# Altium schematic sheet motor_driver.SchDoc
size A4; SheetNumber: 1; SheetTotal: 1
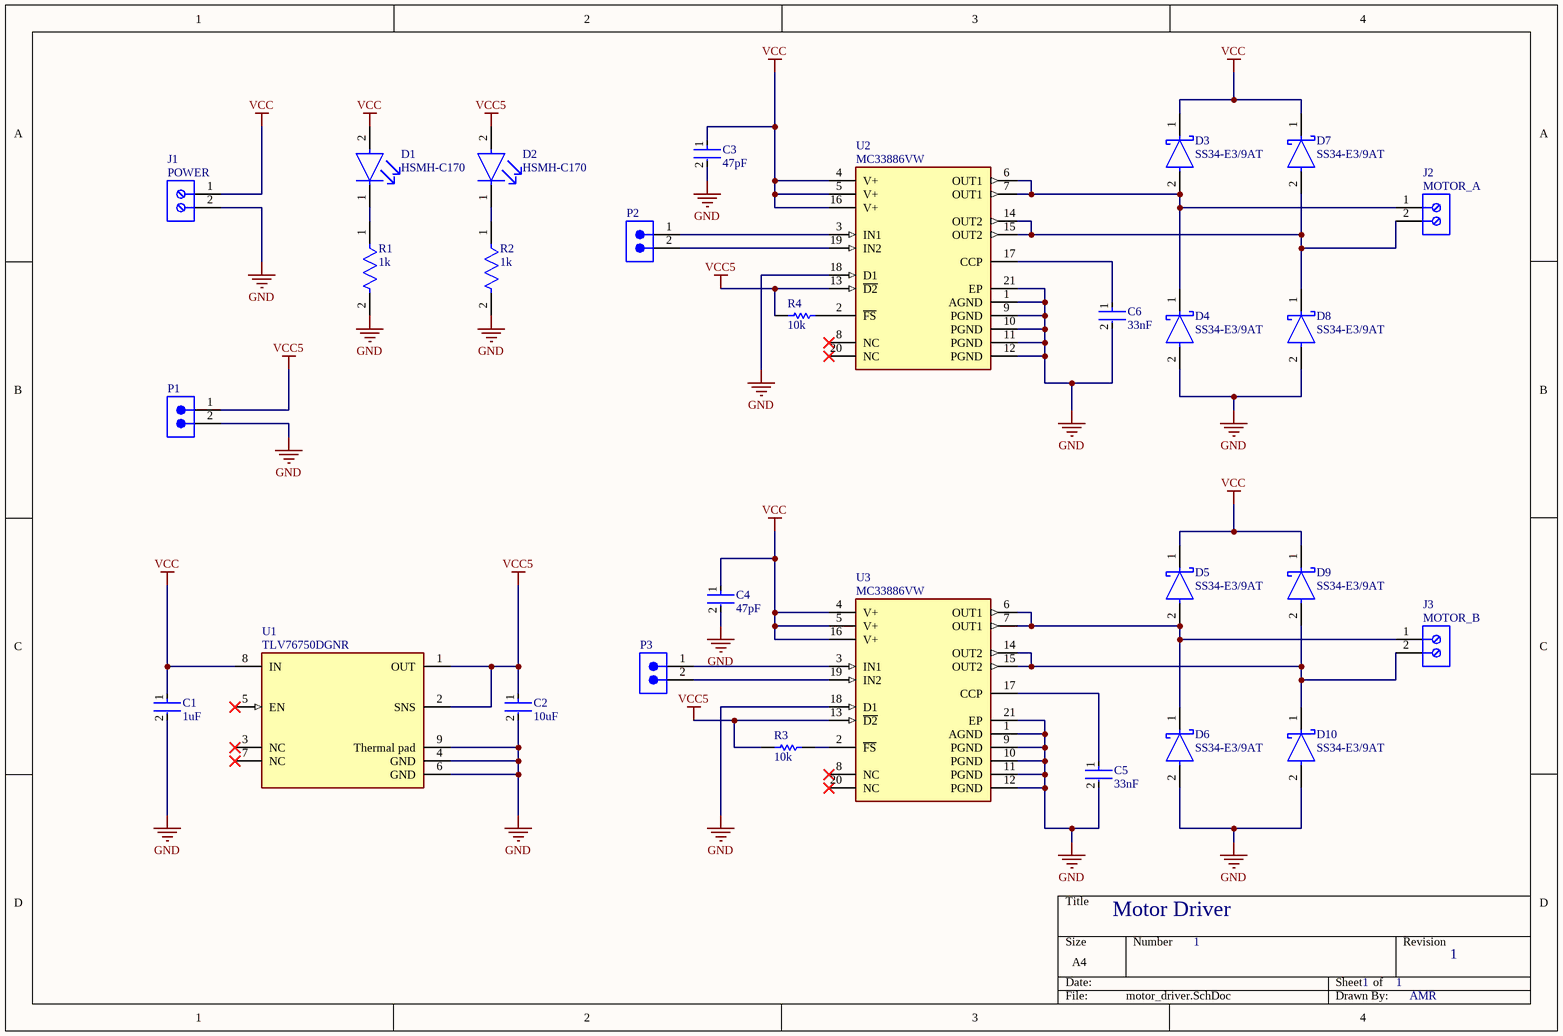
[diagram p0: motor_driver.SchDoc]

## Parts
C1  1uF  [FP-CC0603-DA-IPC_A]
C2  10uF  [FP-GRM188-0_1-e0_2_0_55-IPC_A]
C3  47pF  [FP-C0805C-DN-IPC_A]
C4  47pF  [FP-C0805C-DN-IPC_A]
C5  33nF  [FP-CC0805-0_85-MFG]
C6  33nF  [FP-CC0805-0_85-MFG]
D1  HSMH-C170  [FP-HSMS-C170-MFG]
D2  HSMH-C170  [FP-HSMS-C170-MFG]
D3  SS34-E3/9AT  [FP-SMC-MFG]
D4  SS34-E3/9AT  [FP-SMC-MFG]
D5  SS34-E3/9AT  [FP-SMC-MFG]
D6  SS34-E3/9AT  [FP-SMC-MFG]
D7  SS34-E3/9AT  [FP-SMC-MFG]
D8  SS34-E3/9AT  [FP-SMC-MFG]
D9  SS34-E3/9AT  [FP-SMC-MFG]
D10  SS34-E3/9AT  [FP-SMC-MFG]
J1  POWER  [691103110002]
J2  MOTOR_A  [691103110002]
J3  MOTOR_B  [691103110002]
P1  61300211121  [61300211121]  (value not drawn)
P2  61300211121  [61300211121]  (value not drawn)
P3  61300211121  [61300211121]  (value not drawn)
R1  1k  [FP-RC0603-0_55-IPC_B]
R2  1k  [FP-RC0603-0_55-IPC_B]
R3  10k  [RESC1609X50X30ML8T20]
R4  10k  [RESC1609X50X30ML8T20]
U1  TLV76750DGNR  [FP-DGN0008G-IPC_A]
U2  MC33886VW  [FP-SOT397-2-IPC_A]
U3  MC33886VW  [FP-SOT397-2-IPC_A]

## Nets
GND: C1.2 C2.2 C3.2 C4.2 C5.2 C6.2 D4.2(A) D6.2(A) D8.2(A) D10.2(A) J1.2 P1.2 R1.2 R2.2 U1.4(GND) U1.6(GND) U1.9(Thermal_pad) U2.1(AGND) U2.9(PGND) U2.10(PGND) U2.11(PGND) U2.12(PGND) U2.18(D1) U2.21(EP) U3.1(AGND) U3.9(PGND) U3.10(PGND) U3.11(PGND) U3.12(PGND) U3.18(D1) U3.21(EP)
VCC: C1.1 C3.1 C4.1 D1.2(A) D3.1(C) D5.1(C) D7.1(C) D9.1(C) J1.1 U1.8(IN) U2.4(V+) U2.5(V+) U2.16(V+) U3.4(V+) U3.5(V+) U3.16(V+)
VCC5: C2.1 D2.2(A) P1.1 R3.1 R4.1 U1.1(OUT) U1.2(SNS) U2.13(~{D2}) U3.13(~{D2})
NetC5_1: C5.1 U3.17(CCP)
NetC6_1: C6.1 U2.17(CCP)
NetD1_1: D1.1(C) R1.1
NetD2_1: D2.1(C) R2.1
NetD3_2: D3.2(A) D4.1(C) J2.1 U2.6(OUT1) U2.7(OUT1)
NetD5_2: D5.2(A) D6.1(C) J3.1 U3.6(OUT1) U3.7(OUT1)
NetD7_2: D7.2(A) D8.1(C) J2.2 U2.14(OUT2) U2.15(OUT2)
NetD9_2: D9.2(A) D10.1(C) J3.2 U3.14(OUT2) U3.15(OUT2)
NetP2_1: P2.1 U2.3(IN1)
NetP2_2: P2.2 U2.19(IN2)
NetP3_1: P3.1 U3.3(IN1)
NetP3_2: P3.2 U3.19(IN2)
NetR3_2: R3.2 U3.2(~{FS})
NetR4_2: R4.2 U2.2(~{FS})

Not connected (* = marked no-connect by the designer): U1 3(NC)* 5(EN)* 7(NC)*; U2 8(NC)* 20(NC)*; U3 8(NC)* 20(NC)*

## Notes on the sheet
- Motor Driver
- 1
- AMR

## Library data of the parts
C1 = CMP-2000-05002-2: CAP CER 0.1UF 16V X7R 0603; Manufacturer Part Number: CC0603KRX7R7BB104; Manufacturer: YAGEO; Tolerance: 0.1; Value: 100 nF; Temperature Coefficient: 15%; Material: Ceramic; Voltage Rating: 16 V; Package: CC0603-DA; ComponentLink2Description: Datasheet; Octopart: https://octopart.com/cc0603krx7r7bb104-yageo-192941; Temperature Range High: +125°C; Digikey Description: CAP CER 0.1UF 16V X7R 0603; Voltage: 16 V; Device Class L2: Capacitors; Height: 0.9mm; Temperature: -55°C to +125°C; Device Class L1: Passive Components; Device Class L3: Ceramic Capacitors; ComponentLink2URL: http://www.yageo.com/documents/recent/UPY-GPHC_X7R_6.3V-to-50V_18.pdf; Footprint Url: http://www.yageo.com/exep/pages/download/literatures/UPY-C_GEN_24.pdf; RoHS: TRUE; Temperature Range Low: -55°C; Temperature Characteristic: X7R; Lead Free: Yes; Capacitance: 100 nF; Category: Cap; Mouser Description: Multilayer Ceramic Capacitor, CC Series, 0.1 - F, - 10%, X7R, 16 V, 0603 [1608 Metric]; Automotive: No
C2 = CMP-2006-02792-2: Chip Multilayer Ceramic Capacitors for General Purpose, 0603, 10uF, X5R, 15%, 20%, 6.3V; Packaging: Tape and Reel; Voltage Rating (DC): 6.3V; Width: 0.031inch; Termination: SMD/SMT; Dielectric: X5R; Package Quantity: 4000; Voltage Rating: 6.3V; Capacitance: 10uF; Case/Package: 0603; Min Operating Temperature: -55°C; Voltage: 6.3V; Length: 1.6mm; Thickness: 0.035inch; Lead Free: Lead Free; Depth: 0.8mm; Case Code (Imperial): 0603; Max Operating Temperature: 85°C; Material: Ceramic; Height: 0.8mm; Tolerance: 20%; Mount: Surface Mount; REACH SVHC: No SVHC; Radiation Hardening: No; Case Code (Metric): 1608
C3 C4 = CMP-1036-01631-3: CAP CER 47PF 100V 5% NP0 0805; Manufacturer: KEMET; Manufacturer Part Number: C0805C470J1GACTU; Temperature Characteristic: C0G; Material: Ceramic; Temperature Coefficient: 30ppm/°C; Tolerance: 0.05; Value: 47 pF; Device Class L3: Ceramic Capacitors; Package: C0805C-DN; Category: Cap; ComponentLink2URL: https://content.kemet.com/datasheets/KEM_C1003_C0G_SMD.pdf; Ipc Land Pattern Name: CAPC200125X78; Temperature Range Low: -55°C; Temperature: -55°C to +125°C; Temperature Range High: +125°C; Device Class L2: Capacitors; Height: 0.88mm; Octopart: https://octopart.com/c0805c470j1gactu-kemet-9138638; Digikey Description: CAP CER 47PF 100V 5% NP0 0805; Lead Free: Yes; Voltage Rating: 100 V; Device Class L1: Passive Components; Capacitance: 47 pF; Mouser Description: Capacitor: ceramic; MLCC; 47pF; 100V; C0G; ±5%; SMD; 0805; RoHS: TRUE; ComponentLink2Description: Datasheet; Automotive: No
C5 C6 = CMP-03422-000605-1: CAP CER 0.033UF 25V X7R 0805; Manufacturer Part Number: CC0805KRX7R8BB333; Manufacturer: Yageo; Tolerance: 0.1; Material: Ceramic; Capacitance: 33 nF; Digikey Description: CAP CER 0.033UF 25V X7R 0805; ComponentLink2Description: Datasheet; Device Class L3: Ceramic Capacitors; Package: CC0805-0.85; Device Class L1: Passive Components; Height: 0.95mm; ComponentLink2URL: http://www.yageo.com/documents/recent/UPY-GPHC_Y5V_6.3V-to-50V_8.pdf; RoHS: TRUE; Lead Free: Yes; Voltage Rating: 25 V; Device Class L2: Capacitors; Value: 33 nF; Automotive: No; Octopart: https://octopart.com/cc0805krx7r8bb333-yageo-42623524; Ipc Land Pattern Name: CAPC200125X85; Temperature: -30°C to +85°C; Temperature Range Low: -30°C; Temperature Range High: +85°C; Mouser Description: Multilayer Ceramic Capacitors MLCC - SMD/SMT 33nF 25V X7R 10%; Category: Cap; Footprint Url: http://www.yageo.com/exep/pages/download/literatures/UPY-C_GEN_24.pdf; Temperature Characteristic: X7R
D1 D2 = CMP-18399-000018-1: LED RED DIFFUSED CHIP SMD; Forward Voltage: 2.1V; Shape: Rectangular; Wavelength: 626nm; Power Dissipation: 52mW; Reverse Voltage: 5V; Number of Elements: 1; Lens Color: White; Viewing Angle: 170°; Test Current: 20mA; Luminous Intensity: 10mcd; Number of Terminals: 2; Lead Free: Lead Free; Min Operating Temperature: -40°C; Package Quantity: 1; Depth: 1.25mm; Color: Red; Lens Style: Diffused; Mount: Surface Mount; Length: 2mm; Dominant Wavelength: 626nm; Packaging: Tape and Reel; Case Code (Metric): 2012; Max Operating Temperature: 85°C; Case Code (Imperial): 0805; Case/Package: 0805; Height: 0.8mm; Number of LEDs: 1; Illumination Color: Red; Width: 1.25mm; Radiation Hardening: No; Power Rating: 52mW; REACH SVHC: No SVHC; Number of Pins: 2; Lens Transparency: Diffused; Forward Current: 20mA
D3-D10 = CMP-02539-000066-1: DIODE SCHOTTKY 40V 3A DO214AB; Peak Non-Repetitive Surge Current: 100A; Forward Voltage: 500mV; Element Configuration: Single; Max Reverse Current: 500uA; Case/Package: SMC; Radiation Hardening: No; Series: -; Max Surge Current: 100A; RoHS Compliant: Yes; Min Operating Temperature: -55°C; Average Rectified Current: 3A; Max Reverse Leakage Current: 500uA; Package Quantity: 3500; Max Reverse Voltage (DC): 40V; Forward Current: 3A; Packaging: Tape and Reel; Max Operating Temperature: 125°C; Max Repetitive Reverse Voltage (Vrrm): 40V; Number of Pins: 2; Mount: Surface Mount
J1-J3 = CMP-1502-03254-2: NexarPartId: 18818286; Pitch: 3.5052mm; Current Rating: 10A; Number of Positions Per Level: 2; Plating: Steel; Number of Levels: 1; Voltage: 125V; Wire/Cable Gauge: 26AWG; Stripping Length: -6mm; Wire Gauge (Min): 16AWG; Packaging: Box; Number of Rows: 1; Color: Blue; Height: 8.5mm; Current: 10A; Lead Pitch: 3.5mm; RoHS: Compliant; Housing Material: Nylon; Width: 8mm; Length: 7mm; Contact Plating: Tin; Number of Pins: 2; Mount: Through Hole; Min Operating Temperature: -40°C; Number of Contacts: 2; REACH SVHC: Unknown; Termination: Screw; Wire Gauge (Max): 26AWG; Max Operating Temperature: 105°C; Voltage Rating: 125V; Contact Material: Brass, Copper, Nickel, Tin, Zinc
P1-P3 = CMP-1712-00002-5: NexarPartId: 20081794; Operating Supply Voltage: 250V; Current Rating: 3A; Gender: Male; Number of Contacts: 2; Pitch: 2.54mm; Connector Type: Male Pin; Contact Resistance: 20mΩ; Contact Plating: Gold; Contact Material: Copper; Number of Pins: 2; Min Operating Temperature: -40°C; Packaging: Bulk; Lead Pitch: 2.54mm; Mount: Through Hole; Orientation: Vertical; RoHS: Compliant; REACH SVHC: No SVHC; Height: 8.94mm; Termination: Through Hole; Number of Positions: 2; Contact Mating Length: 5.9944mm; Color: Black; Contact Gender: Male; Number of Rows: 1; Housing Material: PBT; Lead Free: Lead Free; Voltage Rating: 250V; Max Operating Temperature: 125°C
R1 R2 = CMP-1659-00009-5: RES 1K OHM 1% 1/10W 0603; Resistance: 1kR; Voltage Rating: 50V; Power Rating: 100mW; Temperature Coefficient: 100ppm/°C; Military Standard: Not; REACH SVHC: No SVHC; Size Code: 0603; Features: Moisture Resistant; Number of Terminations: 2; Technology: THICK FILM; Series: RC; Case Code (Metric): 1608; Resistance Tolerance: 1%; Resistor Type: Thick Film; Termination: SMD/SMT; Contact Plating: Tin; Radiation Hardening: No; Min Operating Temperature: -55°C; Max Operating Temperature: 155°C; Packaging: Tape and Reel; Max Power Dissipation: 100mW; RoHS Compliant: Yes; Height: 0.45mm; Lead Free: Lead Free; Case/Package: 0603; Length: 1.6mm; Tolerance: 1%; Case Code (Imperial): 0603; Construction: Rectangular; Depth: 0.8mm
R3 R4 = CMP-1666-00005-4: Chip Resistor, 10 KOhm, +/- 1%, 100 mW, -55 to 155 degC, 0603 (1608 Metric), RoHS, Tape and Reel; Manufacturer: Vishay Semiconductor; Voltage Rating: 75 V; Max Operating Temperature: 155 degC; PackageDescription: 2-Pin Surface Mount Device, Body 1.575 x 0.85 mm; ComponentLink1Description: Manufacturer URL; RoHSCompliant: true; PackageReference: 0603; REACH SVHC: Unknown; Length: 1.55 mm; DatasheetVersion: 06/2012; Packaging: Tape and Reel; Min Operating Temperature: -55 degC; Mounting Technology: Surface Mount; ComponentLink2URL: https://datasheet.ciiva.com/11809/0900766b80d98afc-11809037.pdf; Height: 0.45 mm; ComponentLink2Description: Datasheet; Package Quantity: 5000; ComponentLink1URL: http://www.vishay.com/
U1 = CMP-00370-110083557-1: TLV76701DGNR Adjustable- and fixed-output, 1-A, 16-V, positive-voltage low-dropout (LDO) linear regulator 8-HVSSOP -40 to 125; Manufacturer Lifecycle Status: ACTIVE; Dropout Voltage: 900mV; Accuracy: 0.5%; Nominal Supply Current: 1.5mA; Output Current: 1A; Number of Outputs: 1; Min Supply Voltage: 2.5V; Max Junction Temperature (Tj): 125°C; Max Supply Voltage: 16V; Length: 3mm; Max Operating Temperature: 125°C; Width: 3mm; Lifecycle Status: Production; Thickness: 1.02mm; Height: 1.1mm; Min Operating Temperature: -40°C; Number of Pins: 8; Number of Channels: 1; NexarPartId: 110083557
U2 U3 = CMP-10141-000005-1: Motor Driver CMOS Parallel 20-HSOP; Max Output Current: 5A; Number of Outputs: 2; Max Supply Voltage: 40V; Min Supply Voltage: 5V; Nominal Supply Current: 20mA; Max Input Voltage: 7V; Logic Function: AND GATE; Output Voltage: 40V; Output Current: 5A; Case/Package: HSOP; Technology: CMOS; REACH SVHC: No SVHC; Weight: 0.078135oz; Series: -; Number of Pins: 20; RoHS Compliant: Yes; Package Quantity: 30; Supply Current: 20mA; Interface: Parallel; Packaging: Rail/Tube; Max Operating Temperature: 125°C; Termination: SMD/SMT; Mount: Surface Mount; Min Operating Temperature: -40°C